# Altium schematic sheet STM32.SchDoc: TMC2130
size A; DrawnBy: Luka & Emile
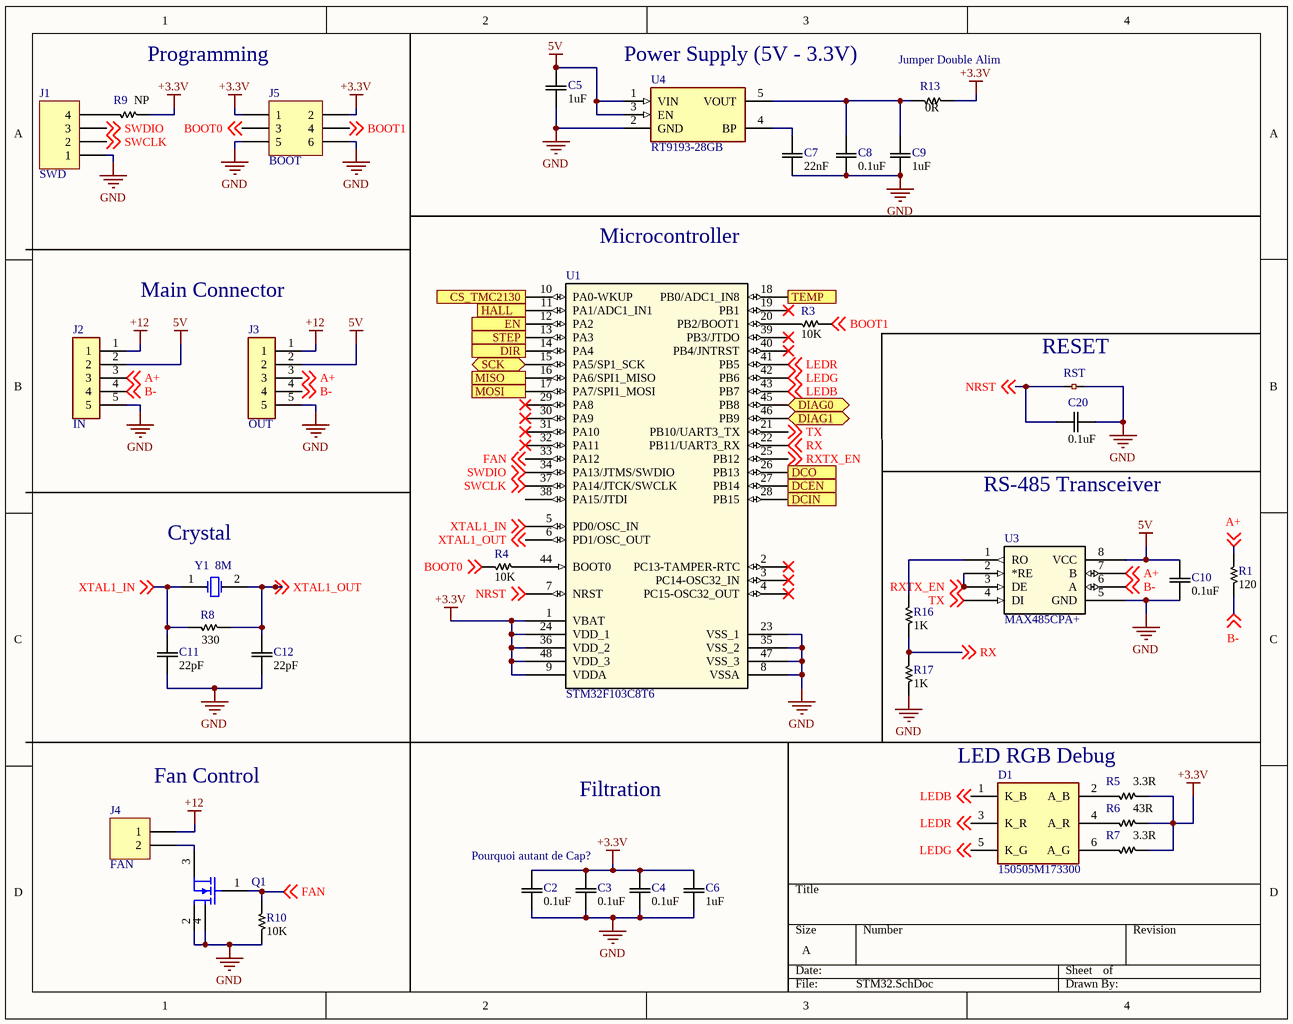
[diagram p0: STM32.SchDoc]

## Parts
C2  value 0.1uF  [0603]  (hidden comment: Capacitor 1206)
C3  value 0.1uF  [0603]  (hidden comment: Capacitor 1206)
C4  value 0.1uF  [0603]  (hidden comment: Capacitor 1206)
C5  value 1uF  [0603]  (hidden comment: Capacitor 1206)
C6  value 1uF  [0603]  (hidden comment: Capacitor 1206)
C7  value 22nF  [0603]  (hidden comment: Capacitor 1206)
C8  value 0.1uF  [0603]  (hidden comment: Capacitor 1206)
C9  value 1uF  [0603]  (hidden comment: Capacitor 1206)
C10  value 0.1uF  [0603]  (hidden comment: Capacitor 1206)
C11  value 22pF  [0603]  (hidden comment: Capacitor 1206)
C12  value 22pF  [0603]  (hidden comment: Capacitor 1206)
C20  value 0.1uF  [0603]  (hidden comment: Capacitor 1206)
D1  150505M173300  [LED 5050]
J1  SWD  [HDR1X4]
J2  IN  [JST 5POS 2.5mm 90°]
J3  OUT  [JST 5POS 2.5mm 90°]
J4  FAN  [HDR1X2]
J5  BOOT  [Header 3x2 1.27mm SMD]
Q1  MOSFET N-CH  [SOT223_M]  (value not drawn)
R1  value 120  [0603]  (hidden comment: Resistor 0603)
R3  value 10K  [0603]  (hidden comment: Resistor 1206)
R4  value 10K  [0603]  (hidden comment: Resistor 1206)
R5  value 3.3R  [0603]  (hidden comment: Resistor 0603)
R6  value 43R  [0603]  (hidden comment: Resistor 0603)
R7  value 3.3R  [0603]  (hidden comment: Resistor 0603)
R8  value 330  [0603]  (hidden comment: Resistor 0603)
R9  value NP  [0603]  (hidden comment: Jumper 0603)
R10  value 10K  [0603]  (hidden comment: Resistor 0603)
R13  value 0R  [0603]  (hidden comment: Jumper 0603)
R16  value 1K  [0603]  (hidden comment: Resistor 0603)
R17  value 1K  [0603]  (hidden comment: Resistor 0603)
RST  PAD  [PAD]  (value not drawn)
U1  STM32F103C8T6  [LQFP-48]
U3  MAX485CPA+  [DIP 8 - 3D]
U4  RT9193-28GB  [SOT94P279X130-5N]
Y1  8M  [ATS080B-E]

## Ports
CS_TMC2130 (out), DCEN (out), DCIN (out), DCO (in), DIAG0 (bidir), DIAG1 (bidir), DIR (out), EN (out), HALL (in), MISO (in), MOSI (out), SCK (bidir), STEP (out), TEMP (in)

## Nets
5V: C5.2 C10.2 J2.2 J3.2 U3.8(VCC) U4.1(VIN) U4.3(EN)
+3.3V: C2.2 C3.2 C4.2 C6.2 J5.1 J5.2 R5.2 R6.2 R7.2 R9.2 R13.2 U1.1(VBAT) U1.9(VDDA) U1.24(VDD_1) U1.36(VDD_2) U1.48(VDD_3)
+12: J2.1 J3.1 J4.1
GND: C2.1 C3.1 C4.1 C5.1 C6.1 C7.1 C8.1 C9.1 C10.1 C11.1 C12.1 C20.1 J1.1 J2.5 J3.5 J5.5 J5.6 Q1.2(D) Q1.4(D) R10.1 R17.2 RST.1 U1.8(VSSA) U1.23(VSS_1) U1.35(VSS_2) U1.47(VSS_3) U3.5(GND) U4.2(GND)
A+: J2.3 J3.3 R1.2 U3.7(B) ; off-sheet A+
B-: J2.4 J3.4 R1.1 U3.6(A) ; off-sheet B-
BOOT0: J5.3 R4.1 ; off-sheet BOOT0
BOOT1: J5.4 R3.2 ; off-sheet BOOT1
CS_TMC2130: U1.10(PA0-WKUP) ; port CS_TMC2130
DCEN: U1.27(PB14) ; port DCEN
DCIN: U1.28(PB15) ; port DCIN
DCO: U1.26(PB13) ; port DCO
DIAG0: U1.45(PB8) ; port DIAG0
DIAG1: U1.46(PB9) ; port DIAG1
DIR: U1.14(PA4) ; port DIR
EN: U1.12(PA2) ; port EN
FAN: Q1.1(G) R10.2 U1.33(PA12) ; off-sheet FAN
HALL: U1.11(PA1/ADC1_IN1) ; port HALL
LEDB: D1.1(K_B) U1.43(PB7) ; off-sheet LEDB
LEDG: D1.5(K_G) U1.42(PB6) ; off-sheet LEDG
LEDR: D1.3(K_R) U1.41(PB5) ; off-sheet LEDR
MISO: U1.16(PA6/SPI1_MISO) ; port MISO
MOSI: U1.17(PA7/SPI1_MOSI) ; port MOSI
NRST: C20.2 RST.2 U1.7(NRST) ; off-sheet NRST
RX: R16.2 R17.1 U1.22(PB11/UART3_RX) ; off-sheet RX
RXTX_EN: U1.25(PB12) U3.2(*RE) U3.3(DE) ; off-sheet RXTX_EN
SCK: U1.15(PA5/SP1_SCK) ; port SCK
STEP: U1.13(PA3) ; port STEP
SWCLK: J1.2 U1.37(PA14/JTCK/SWCLK) ; off-sheet SWCLK
SWDIO: J1.3 U1.34(PA13/JTMS/SWDIO) ; off-sheet SWDIO
TEMP: U1.18(PB0/ADC1_IN8) ; port TEMP
TX: U1.21(PB10/UART3_TX) U3.4(DI) ; off-sheet TX
XTAL1_IN: C11.2 R8.1 U1.5(PD0/OSC_IN) Y1.1(OSC1) ; off-sheet XTAL1_IN
XTAL1_OUT: C12.2 R8.2 U1.6(PD1/OSC_OUT) Y1.2(OSC2) ; off-sheet XTAL1_OUT
NetC7_2: C7.2 U4.4(BP)
NetC8_2: C8.2 C9.2 R13.1 U4.5(VOUT)
NetD1_2: D1.2(A_B) R5.1
NetD1_4: D1.4(A_R) R6.1
NetD1_6: D1.6(A_G) R7.1
NetJ1_4: J1.4 R9.1
NetJ4_2: J4.2 Q1.3(S)
NetR3_1: R3.1 U1.20(PB2/BOOT1)
NetR4_2: R4.2 U1.44(BOOT0)
NetR16_1: R16.1 U3.1(RO)

Not connected (* = marked no-connect by the designer): U1 2(PC13-TAMPER-RTC)* 3(PC14-OSC32_IN)* 4(PC15-OSC32_OUT)* 19(PB1)* 29(PA8)* 30(PA9)* 31(PA10)* 32(PA11)* 38(PA15/JTDI) 39(PB3/JTDO)* 40(PB4/JNTRST)*

## Notes on the sheet
- Programming
- Power Supply (5V - 3.3V)
- (near R13) Jumper Double Alim
- Main Connector
- Microcontroller
- (near RST) RESET
- RS-485 Transceiver
- (near Y1) Crystal
- LED RGB Debug
- (near J4) Fan Control
- Filtration
- Pourquoi autant de Cap?

## Library data of the parts
C2-C12 C20 = Capacitor 1206: Capacitor SMD 1206; Manufacturer_Part_Number: 12065A820JAT2A; Vendor: AVX Corporation; Built_By: EMA_UL_Team; Type: DEV; Copyright: Copyright (C) 2018 Accelerated Designs. All rights reserved; RefDes: RefDes
D1 = 150505M173300: LED; Manufacturer_Name: Wurth Elektronik; Datasheet Link: https://katalog.we-online.de/led/datasheet/150505M173300.pdf; Height: 1.8mm; Manufacturer_Part_Number: 150505M173300; Mouser Part Number: 710-150505M173300; Mouser Price/Stock: https://www.mouser.com/Search/Refine.aspx?Keyword=710-150505M173300; RS Part Number: 1766248P; RS Price/Stock: http://uk.rs-online.com/web/p/products/1766248P
J1 = Header 4: Header, 4-Pin; LatestRevisionDate: 17-Jul-2002; LatestRevisionNote: Re-released for DXP Platform.; Publisher: Altium Limited
J2 J3 = JST 5POS: Connector; Manufacturer_Name: JST (JAPAN SOLDERLESS TERMINALS); Manufacturer_Part_Number: S5B-XH-A-1(LF)(SN); Datasheet Link: http://www.jst-mfg.com/product/pdf/eng/eXH.pdf; Height: 6.1mm
J4 = Header 2: Header, 2-Pin; LatestRevisionDate: 17-Jul-2002; LatestRevisionNote: Re-released for DXP Platform.; Publisher: Altium Limited
J5 = Header 3X2: Header, 3-Pin, Dual row; LatestRevisionDate: 17-Jul-2002; LatestRevisionNote: Re-released for DXP Platform.; Publisher: Altium Limited
Q1 = MOSFET N-CH: 55V 7A SOT223; ComponentLink1Description: Datasheet; ComponentLink1URL: https://assets.nexperia.com/documents/data-sheet/BUK9880-55A.pdf; ComponentLink2Description: Digikey; ComponentLink2URL: https://www.digikey.ca/product-detail/en/BUK9880-55A%2fCUX/1727-2230-1-ND/5361200/?itemSeq=318542302
R1 R5-R8 R10 R16 R17 = Resistor 1206: Resistor 0603 SMD; Manufacturer_Part_Number: ERJ8CWFR024V; Vendor: Panasonic; Built_By: EMA_Cory; Copyright: Copyright (C) 2018 Accelerated Designs. All rights reserved; RefDes: RefDes; Type: DEV
R3 R4 R9 R13 = Resistor 1206: Resistor 1206 SMD; Manufacturer_Part_Number: ERJ8CWFR024V; Vendor: Panasonic; Built_By: EMA_Cory; Copyright: Copyright (C) 2018 Accelerated Designs. All rights reserved; RefDes: RefDes; Type: DEV
RST = PAD: SMD Pad for contact
U1 = STM32F103C8T6: Integrated Circuit STM32; Vendor: STMicroelectronics; Built_By: EMA_UL_Team; Manufacturer_Part_Number: STM32F103C8T6; Copyright: Copyright (C) 2018 Accelerated Designs. All rights reserved; RefDes: RefDes; Type: DEV; Value: Value
U3 = MAX485CPA+: RS485 Communication; Vendor: Maxim Integrated Products; Built_By: EMA_UL_Team; Manufacturer_Part_Number: MAX485CPA+; Copyright: Copyright (C) 2018 Accelerated Designs. All rights reserved; RefDes: RefDes; Type: DEV; Value: Value
U4 = RT9193-28GB: Voltage Regulator 3.3V; Manufacturer_Name: RICHTEK; Datasheet Link: https://componentsearchengine.com/Datasheets/2/RT9193-28GB.pdf; Height: 1.295mm; Manufacturer_Part_Number: RT9193-28GB
Y1 = XTAL: Crystal Oscillator; Published: 8-Jun-2000; LatestRevisionDate: 17-Jul-2002; LatestRevisionNote: Re-released for DXP Platform.; PackageReference: R38; Publisher: Altium Limited; PackageDescription: Crystal, Thru-Hole; 2 Leads; Body 3.1 x 8.2 mm (Dia.xH)